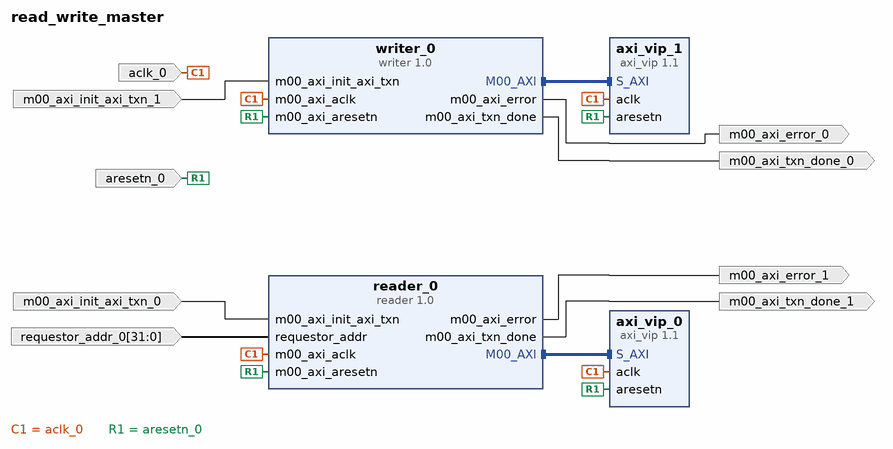
[diagram p0: block diagram of the top level]
# Vivado block design read_write_master, xczu9eg-ffvb1156-2-e, Vivado 2017.4
create_bd_design read_write_master

create_bd_port -dir I -type clk aclk_0
create_bd_port -dir I -type rst aresetn_0
create_bd_port -dir I m00_axi_init_axi_txn_0
create_bd_port -dir O m00_axi_error_0
create_bd_port -dir O m00_axi_txn_done_0
create_bd_port -dir O m00_axi_error_1
create_bd_port -dir O m00_axi_txn_done_1
create_bd_port -dir I m00_axi_init_axi_txn_1
create_bd_port -dir I -from 31 -to 0 requestor_addr_0

create_bd_cell -type ip -vlnv user.org:user:writer:1.0 writer_0
create_bd_cell -type ip -vlnv xilinx.com:ip:axi_vip:1.1 axi_vip_0
set_property -dict {CONFIG.INTERFACE_MODE SLAVE} [get_bd_cells axi_vip_0]
create_bd_cell -type ip -vlnv xilinx.com:ip:axi_vip:1.1 axi_vip_1
set_property -dict {CONFIG.INTERFACE_MODE SLAVE} [get_bd_cells axi_vip_1]
create_bd_cell -type ip -vlnv user.org:user:reader:1.0 reader_0
set_property -dict {CONFIG.C_M00_AXI_DATA_WIDTH 128} [get_bd_cells reader_0]

# ---- connections ----

connect_bd_intf_net [get_bd_intf_pins reader_0/M00_AXI] [get_bd_intf_pins axi_vip_0/S_AXI]
connect_bd_intf_net [get_bd_intf_pins writer_0/M00_AXI] [get_bd_intf_pins axi_vip_1/S_AXI]
connect_bd_net -net aclk_0_1 [get_bd_ports aclk_0] \
  [get_bd_pins axi_vip_0/aclk] [get_bd_pins axi_vip_1/aclk] [get_bd_pins writer_0/m00_axi_aclk] \
  [get_bd_pins reader_0/m00_axi_aclk]
connect_bd_net -net aresetn_0_1 [get_bd_ports aresetn_0] \
  [get_bd_pins axi_vip_0/aresetn] [get_bd_pins writer_0/m00_axi_aresetn] [get_bd_pins axi_vip_1/aresetn] \
  [get_bd_pins reader_0/m00_axi_aresetn]
connect_bd_net -net m00_axi_init_axi_txn_0_1 [get_bd_ports m00_axi_init_axi_txn_0] [get_bd_pins reader_0/m00_axi_init_axi_txn]
connect_bd_net [get_bd_pins writer_0/m00_axi_error] [get_bd_ports m00_axi_error_0]
connect_bd_net [get_bd_pins writer_0/m00_axi_txn_done] [get_bd_ports m00_axi_txn_done_0]
connect_bd_net [get_bd_pins reader_0/m00_axi_error] [get_bd_ports m00_axi_error_1]
connect_bd_net [get_bd_pins reader_0/m00_axi_txn_done] [get_bd_ports m00_axi_txn_done_1]
connect_bd_net -net m00_axi_init_axi_txn_1_1 [get_bd_ports m00_axi_init_axi_txn_1] [get_bd_pins writer_0/m00_axi_init_axi_txn]
connect_bd_net -net requestor_addr_0_1 [get_bd_ports requestor_addr_0] [get_bd_pins reader_0/requestor_addr]

# ---- address map ----
assign_bd_address -offset 0x44A00000 -range 64K -target_address_space [get_bd_addr_spaces reader_0/M00_AXI] [get_bd_addr_segs axi_vip_0/S_AXI/Reg]
assign_bd_address -offset 0x44A00000 -range 64K -target_address_space [get_bd_addr_spaces writer_0/M00_AXI] [get_bd_addr_segs axi_vip_1/S_AXI/Reg]

validate_bd_design
save_bd_design
